# EAGLE design LM1117SW (EAGLE 7.4.0)
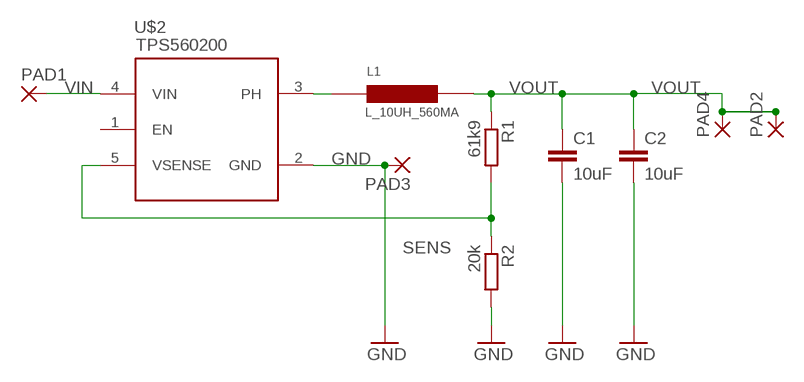
[diagram p0: schematic, sheet 1]

## Parts
C1  10uF  C-EUC0805K  [C0805K]
C2  10uF  C-EUC0805K  [C0805K]
L1  L_10UH_560MA  [TYS3010100M-10]
PAD1  1,6/0,9  [1,6/0,9]
PAD2  1,6/0,9  [1,6/0,9]
PAD3  1,6/0,9  [1,6/0,9]
PAD4  1,6/0,9  [1,6/0,9]
R1  61k9  R-EU_R0402  [R0402]
R2  20k  R-EU_R0402  [R0402]
U$2  TPS560200  [SOT23-5]

## Nets
GND [power]: C1.2 C2.2 PAD3.1(P) R2.2 U$2.2(GND)
N$1 [power]: L1.P$1 U$2.3(PH)
SENS: R1.2 R2.1 U$2.5(VSENSE)
VIN [power]: PAD1.1(P) U$2.4(VIN)
VOUT [power]: C1.1 C2.1 L1.P$2 PAD2.1(P) PAD4.1(P) R1.1
Unconnected: U$2.1(EN)

## Library data of the parts
C1 C2 = rcl:C-EU: CAPACITOR, European symbol; MF: MULTICOMP; MPN: MC0805X106K250CT; OC_FARNELL: 2320833
L1 = Fabian:L_10UH_560MA; MF: LAIRD TECHNOLOGIES; MPN: TYS3010100M-10; OC_FARNELL: 2292503
PAD1-PAD4 = wirepad:1,6/0,9: THROUGH-HOLE PAD; OC_FARNELL: unknown
R1 = rcl:R-EU_: RESISTOR, European symbol; MF: MULTICOMP; MPN: MC00625W0402161K9; OC_FARNELL: 1803730
R2 = rcl:R-EU_: RESISTOR, European symbol; MF: VISHAY DRALORIC; MPN: CRCW040220K0FKED; OC_FARNELL: 1469693
U$2 = Fabian:TPS560200; MF: TEXAS INSTRUMENTS; MPN: TPS560200DBVT; OC_FARNELL: 2373566

## Net classes
1 power: width 0.61 mm

## Board
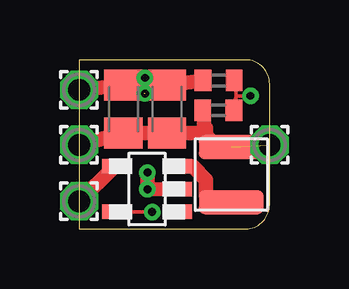
[diagram p1: board, top side]
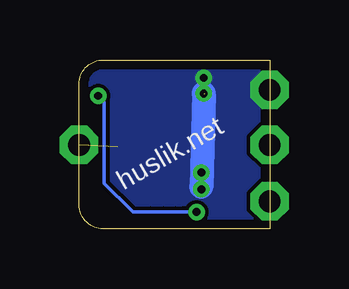
[diagram p2: board, bottom side, seen from below]

Size 7.95 x 7.05 mm. Coordinates in mm from the lower left corner, seen from the top.
Outline: 0,0 6.95,0 arc90 7.95,1 7.95,6.05 arc90 6.95,7.05 0,7.05 0,0
Copper layers (1*16): Top 0.0356mm / dielectric 1.5011mm / Bottom 0.0356mm
Design rules "OSHpark-LaenPCBOrder *": minimum track width 6mil, minimum drill 13mil, track to track 6mil, track to pad 6mil, pad to pad 6mil, via to via 6mil, smd to smd 6mil, copper to edge 15mil, drill to drill 6mil, minimum pad ring 7mil, minimum via ring 7mil, stop-mask expansion 3mil, vias tented up to drill 0.5mm, thermal gap 10mil

### Footprints (pad centres in the part's own frame; a part is rotated, then mirrored left to right if it is on the bottom)
C0805K = smd 1.3 x 1.6: 1 -1,0; 2 1,0
TYS3010100M-10 = smd 1 x 2.7: P$1 -1.15,0; P$2 1.15,0
1,6/0,9 = drill 0.914 pad 1.6 octagon: 1 0,0
R0402 = smd 0.7 x 0.9: 1 -0.65,0; 2 0.65,0
SOT23-5 = smd 0.6 x 1.05: 1 -0.95,-1.35; 2 0,-1.35; 3 0.95,-1.35; 4 0.95,1.35; 5 -0.95,1.35

### Placement (x,y rotation side)
C1  3.67,5 90 top
C2  1.85,5 90 top
L1  6.35,2.26 90 top
PAD1  0,1.15 0 top
PAD2  0,3.5 0 top
PAD3  0,5.8 0 top
PAD4  7.95,3.5 0 top
R1  5.81,4.95 0 top
R2  5.82,6.19 180 top
U$2  2.84,1.66 90 top

### Tracks (layer width: path | path; a pad name or v marks a point on that pad's centre or on a via)
GND  (via drill 0.33)  (1 unrouted)
  Top 0.61: C2.2 PAD3.1 | R2.2 C1.2 3.4,6 3.05,6 v2.75,6.3 | U$2.2 v2.85,1.65 v2.85,2.35 | 3,5.95 2.7,5.65
  Bottom 0.61: 2.85,1.75 v2.85,2.35 2.85,1.75 | 2.85,1.75 v2.85,1.65
  Bottom 1: v2.75,5.65 2.85,1.75
  pour Bottom (no thermals): -0.05,7.2 8.05,7.25 8.05,-0.45 -0.05,-0.45
N$1
  Top 0.61: L1.P$1 5.65,1.1 5.3,1.45 5.3,2.05 4.75,2.6 U$2.3
SENS  (via drill 0.33)
  Top 0.152: 6.55,5.55 6.55,5.9 R2.1 | 6.55,5.55 6.55,5.3 6.5,4.8 R1.2 6.55,5.55 | v3.05,0.7 U$2.5 | 6.55,5.55 v7.15,5.55
  Bottom 0.152: v7.15,5.55 6.9,5.3 6.9,1.95 6.9,1.9 5.75,0.75 5.7,0.7 5,0.7 4.95,0.7 4.45,0.7 4.4,0.7 3.95,0.7 3.9,0.7 3.65,0.7 3.6,0.7 v3.05,0.7
VIN
  Top 0.61: U$2.4 PAD1.1
VOUT  (1 unrouted)
  Top 0.61: L1.P$2 5.8,3.4 5.3,3.9 5.3,4.2 5.2,4 | 5.2,4 5.2,4.8 R1.1 | PAD2.1 C2.1 C1.1 5.2,4

### Text on the board
bPlace: huslik.net
tDocu: GND | OUT | IN